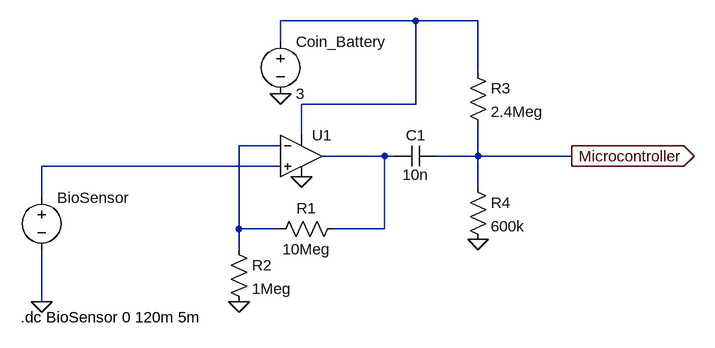
[diagram p0: schematic Bio Amplifier.asc]
Bio Amplifier.asc, the LTspice schematic file:
Version 4
SHEET 1 2440 1028
WIRE 1104 496 896 496
WIRE 1200 496 1104 496
WIRE 896 528 896 496
WIRE 1200 576 1200 496
WIRE 1104 624 1104 496
WIRE 1104 624 928 624
WIRE 928 672 928 624
WIRE 896 688 832 688
WIRE 1056 704 960 704
WIRE 1072 704 1056 704
WIRE 1200 704 1200 656
WIRE 1200 704 1136 704
WIRE 1344 704 1200 704
WIRE 896 720 528 720
WIRE 1200 752 1200 704
WIRE 528 768 528 720
WIRE 832 816 832 688
WIRE 896 816 832 816
WIRE 1056 816 1056 704
WIRE 1056 816 976 816
WIRE 832 848 832 816
WIRE 528 928 528 848
FLAG 528 928 0
FLAG 832 928 0
FLAG 1200 832 0
FLAG 896 608 0
FLAG 1344 704 Microcontroller
IOPIN 1344 704 Out
FLAG 928 736 0
SYMBOL voltage 528 752 R0
WINDOW 3 24 44 Left 2
WINDOW 123 0 0 Left 0
WINDOW 39 0 0 Left 0
SYMATTR Value ""
SYMATTR InstName BioSensor
SYMBOL res 816 832 R0
SYMATTR InstName R2
SYMATTR Value 1Meg
SYMBOL res 992 800 R90
WINDOW 0 0 56 VBottom 2
WINDOW 3 32 56 VTop 2
SYMATTR InstName R1
SYMATTR Value 10Meg
SYMBOL res 1184 560 R0
SYMATTR InstName R3
SYMATTR Value 2.4Meg
SYMBOL res 1184 736 R0
SYMATTR InstName R4
SYMATTR Value 600k
SYMBOL voltage 896 512 R0
WINDOW 123 0 0 Left 0
WINDOW 39 0 0 Left 0
SYMATTR InstName Coin_Battery
SYMATTR Value 3
SYMBOL OpAmps\\UniversalOpamp 928 704 R0
SYMATTR InstName U1
SYMBOL cap 1136 688 R90
WINDOW 0 0 32 VBottom 2
WINDOW 3 29 32 VTop 2
SYMATTR InstName C1
SYMATTR Value 10n
TEXT 496 952 Left 2 !.dc BioSensor 0 120m 5m

The netlist it stands for:
* Bio Amplifier.asc
V§BioSensor N004 0
R2 N002 0 1Meg
R1 N003 N002 10Meg
R3 N001 Microcontroller 2.4Meg
R4 Microcontroller 0 600k
V§Coin_Battery N001 0 3
XU1 N004 N002 N001 0 N003 level1 Avol=1Meg GBW=10Meg Vos=0 En=0 Enk=0 In=0 Ink=0 Rin=500Meg  ; pins In+ In- V+ V- OUT
C1 Microcontroller N003 10n
.dc BioSensor 0 120m 5m
.lib UniversalOpAmp1.lib
.backanno
.end